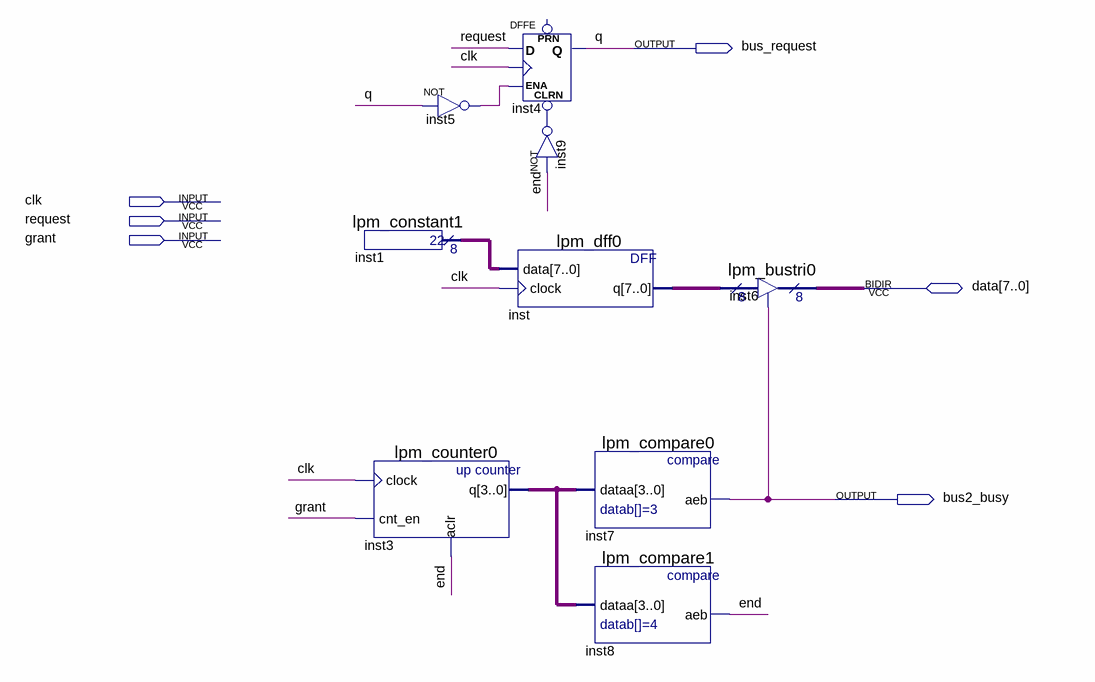
[diagram p0: schematic sheet]
// Quartus schematic Device2.bdf as structural Verilog: 9 symbols, 6 pins
module Device2 (
  input  clk,
  input  request,
  input  grant,
  inout  [7:0] data,
  output bus_request,
  output bus2_busy
);

  wire \end , inst5_out, inst9_out;
  wire [3:0] inst3_q;
  wire [7:0] inst1_result, inst_q;

  lpm_constant1 inst1 (.result(inst1_result));
  lpm_counter0 inst3 (.clock(clk), .cnt_en(grant), .aclr(\end ), .q(inst3_q));
  not inst5 (inst5_out, bus_request);
  DFFE inst4 (.CLRN(inst9_out), .D(request), .CLK(clk), .ENA(inst5_out), .Q(bus_request));  // open: PRN
  not inst9 (inst9_out, \end );
  lpm_dff0 inst (.data(inst1_result), .clock(clk), .q(inst_q));
  lpm_compare0 inst7 (.dataa(inst3_q), .aeb(bus2_busy));
  lpm_compare1 inst8 (.dataa(inst3_q), .aeb(\end ));
  lpm_bustri0 inst6 (.enabledt(bus2_busy), .data(inst_q), .tridata(data));

  // Other names for the same wires on the sheet: q = bus_request
endmodule
